# EAGLE design Sprite (EAGLE 6.6.0)

## Sheet 1 of 2
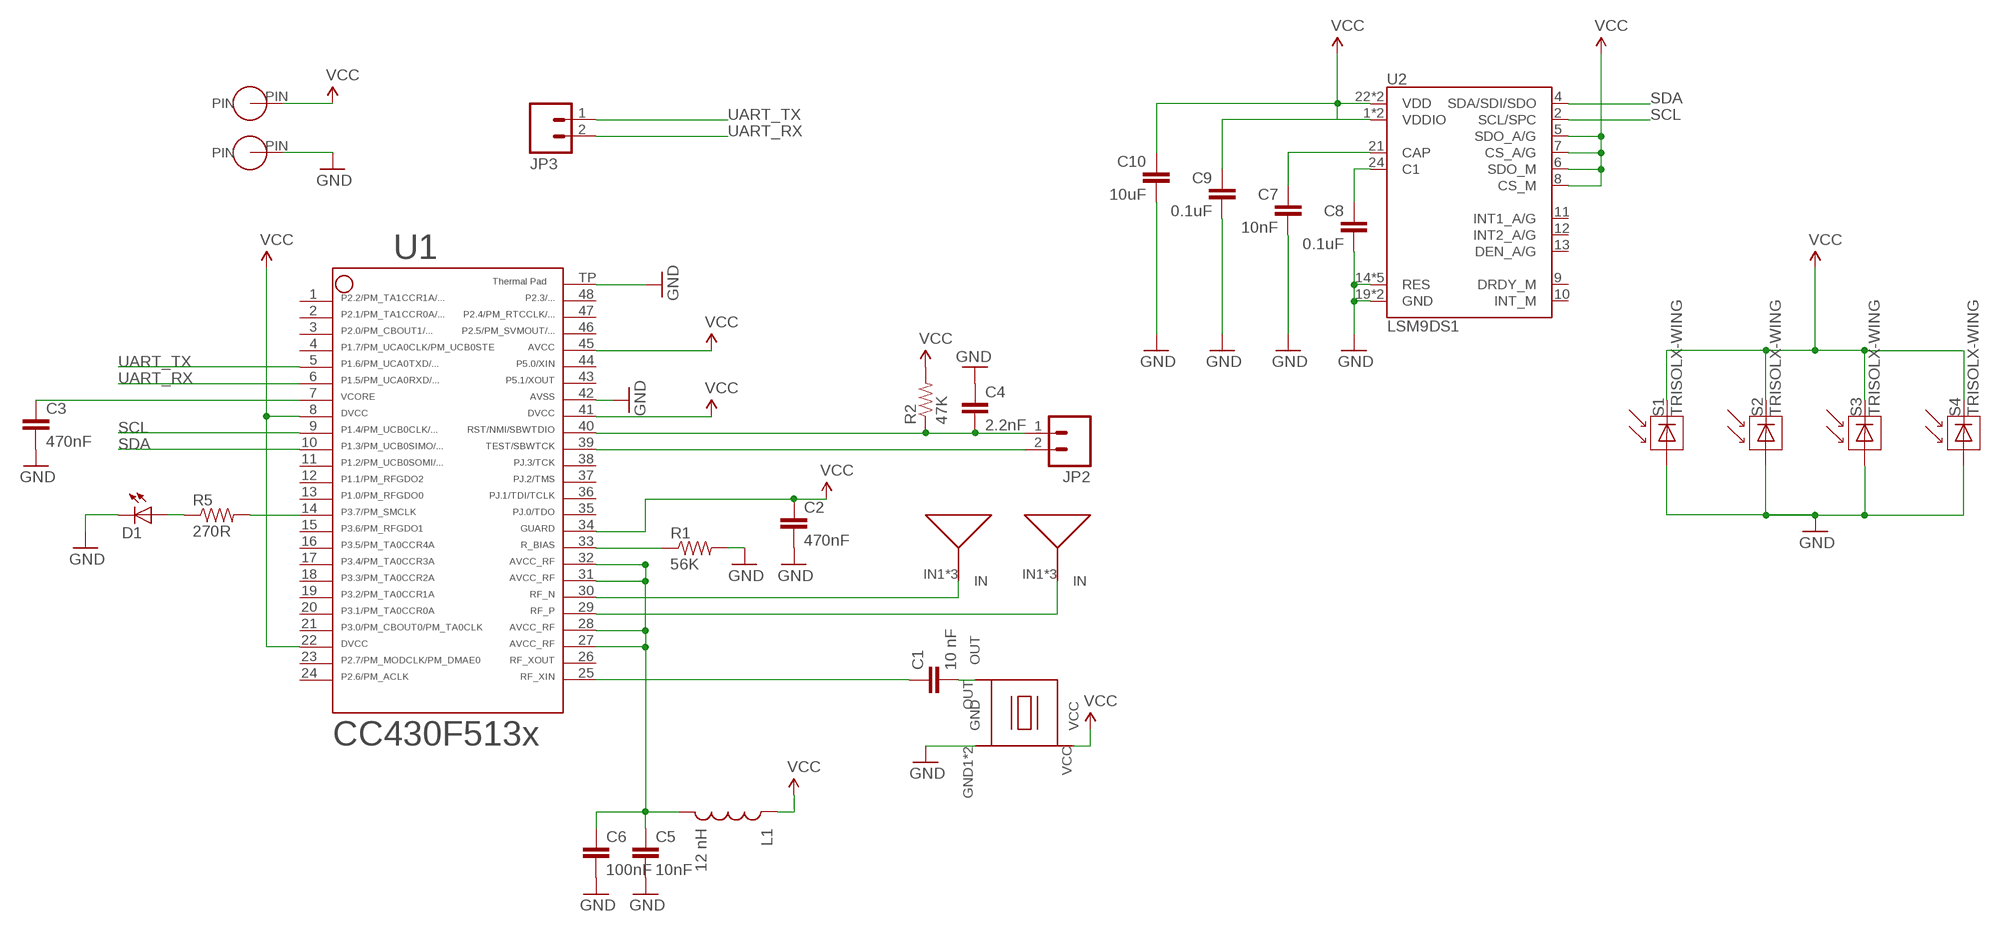
[diagram p0: schematic, sheet 1]

### Parts
ANT-N  ANTENNA  [ANTENNA]
ANT-P  ANTENNA  [ANTENNA]
C1  10 nF  CAP0603-CAP  [0603-CAP]
C2  470nF  CAP0603-CAP  [0603-CAP]
C3  470nF  CAP0603-CAP  [0603-CAP]
C4  2.2nF  CAP0603-CAP  [0603-CAP]
C5  10nF  CAP0603-CAP  [0603-CAP]
C6  100nF  CAP0603-CAP  [0603-CAP]
C7  10nF  CAP0603-CAP  [0603-CAP]
C8  0.1uF  CAP0603-CAP  [0603-CAP]
C9  0.1uF  CAP0603-CAP  [0603-CAP]
C10  10uF  CAP0603-CAP  [0603-CAP]
D1  LED0603  [LED-0603]
JP2  M02PTH  [1X02]
JP3  M02PTH  [1X02]
L1  12 nH  INDUCTOR0603  [0603]
P1  SPRITE_PIN  [SPRITE_PIN]
P2  SPRITE_PIN  [SPRITE_PIN]
R1  56K  RESISTOR0603-RES  [0603-RES]
R2  47K  RESISTOR0603-RES  [0603-RES]
R5  270R  RESISTOR0603-RES  [0603-RES]
S1  TRISOLX-WING  [TRISOLX-T01]
S2  TRISOLX-WING  [TRISOLX-T01]
S3  TRISOLX-WING  [TRISOLX-T01]
S4  TRISOLX-WING  [TRISOLX-T01]
U1  CC430F5137  CC430F513X---RGZ48  [RGZ48]
U2  LSM9DS1  [LGA24-8X4]
X1  TCXO_7Z  [TXC_7Z]

### Nets
GND: C2.2 C3.2 C4.1 C5.2 C6.2 C7.2 C8.2 C9.2 C10.2 D1.C P2.PIN R1.2 S1.P$3(A) S2.P$3(A) S3.P$3(A) S4.P$3(A) U1.42 U1.TP U2.14(RES) U2.15(RES) U2.16(RES) U2.17(RES) U2.18(RES) U2.19(GND) U2.20(GND) X1.GND1(GND) X1.GND2(GND)
N$1: C1.1 U1.25
N$2: R5.2 U1.14
N$3: R1.1 U1.33
N$4: C3.1 U1.7
N$5: C7.1 U2.21(CAP)
N$6: C8.1 U2.24(C1)
N$11: D1.A R5.1
N$12: C1.2 X1.OUT
RFN: ANT-N.IN1(IN) ANT-N.IN2(IN) ANT-N.IN3(IN) U1.30
RFP: ANT-P.IN1(IN) ANT-P.IN2(IN) ANT-P.IN3(IN) U1.29
RST: C4.2 JP2.1 R2.1 U1.40
SCL: U1.9 U2.2(SCL/SPC)
SDA: U1.10 U2.4(SDA/SDI/SDO)
TEST: JP2.2 U1.39
UART_RX: JP3.2 U1.6
UART_TX: JP3.1 U1.5
VCC: C2.1 C9.1 C10.1 L1.1 P1.PIN R2.2 S1.P$2(C) S2.P$2(C) S3.P$2(C) S4.P$2(C) U1.8 U1.22 U1.34 U1.41 U1.45 U2.1(VDDIO) U2.3(VDDIO) U2.5(SDO_A/G) U2.6(SDO_M) U2.7(CS_A/G) U2.8(CS_M) U2.22(VDD) U2.23(VDD) X1.VCC
VCCRF: C5.1 C6.1 L1.2 U1.27 U1.28 U1.31 U1.32
Unconnected: U1.1 U1.2 U1.3 U1.4 U1.11 U1.12 U1.13 U1.15 U1.16 U1.17 U1.18 U1.19 U1.20 U1.21 U1.23 U1.24 U1.26 U1.35 U1.36 U1.37 U1.38 U1.43 U1.44 U1.46 U1.47 U1.48 U2.9(DRDY_M) U2.10(INT_M) U2.11(INT1_A/G) U2.12(INT2_A/G) U2.13(DEN_A/G)

## Sheet 2 of 2

## Library data of the parts
ANT-N ANT-P = SpriteAntenna:ANTENNA
C1-C10 = SparkFun:CAP: Capacitor Standard 0603 ceramic capacitor, and 0.1" leaded capacitor.
D1 = SparkFun:LED: LEDs Standard schematic elements and footprints for 5mm, 3mm, 1206, and 0603 sized LEDs. 5mm - Spark Fun Electronics SKU : COM-00529 (and others)
JP2 JP3 = SparkFun:M02: Header 2 Standard 2-pin 0.1" header. Use with straight break away headers (SKU : PRT-00116), right angle break away headers (PRT-00553), swiss pins (PRT-00743), machine pins (PRT-00117), and female headers (PRT-00115). Molex polarized connector foot print use with SKU : PRT-08233 with associated crimp pins and housings.
L1 = SparkFun:INDUCTOR: Inductors Basic Inductor/Choke - 0603 and 1206. Footprints are not proven and vary greatly between part numbers.
P1 P2 = SpritePin:SPRITE_PIN
R1 R2 R5 = SparkFun:RESISTOR: Resistor Basic schematic elements and footprints for 0603, 1206, and PTH resistors.
S1-S4 = TriSolX_QzQube:TRISOLX-WING
U1 = TI_MSP430_v16:CC430F513X---RGZ48: ***CC430F513X***RGZ48 ** ** Rev 1.0 ** 06/2010 * http://focus.ti.com/docs/prod/folders/print/cc430f5137.html
U2 = LSM9DS1:LSM9DS1: LSM9DS1 3D accelerometer, gyroscope & magnetometer The LSM9DS1 is a system-in-package featuring a 3D digital linear acceleration sensor, a 3D digital angular rate sensor, and a 3D digital magnetic sensor. The LSM9DS1 has a linear acceleration full scale of ±2g/±4g/±8/±16 g, a magnetic field full scale of ±4/±8/±12/±16 gauss and an angular rate of ±245/±500/±2000 dps. The LSM9DS1 includes an I2 C serial bus interface supporting standard and fast mode (100 kHz and 400 kHz) and an SPI serial standard interface. Magnetic, accelerometer and gyroscope sensing can be enabled or set in power-down mode separately for smart power management. The LSM9DS1 is available in a plastic land grid array package (LGA) and it is guaranteed to operate over an extended temperature range from -40 °C to +85 °C.; PROD_ID: IC-12536
X1 = SpriteTCXO:TCXO_7Z

## Board
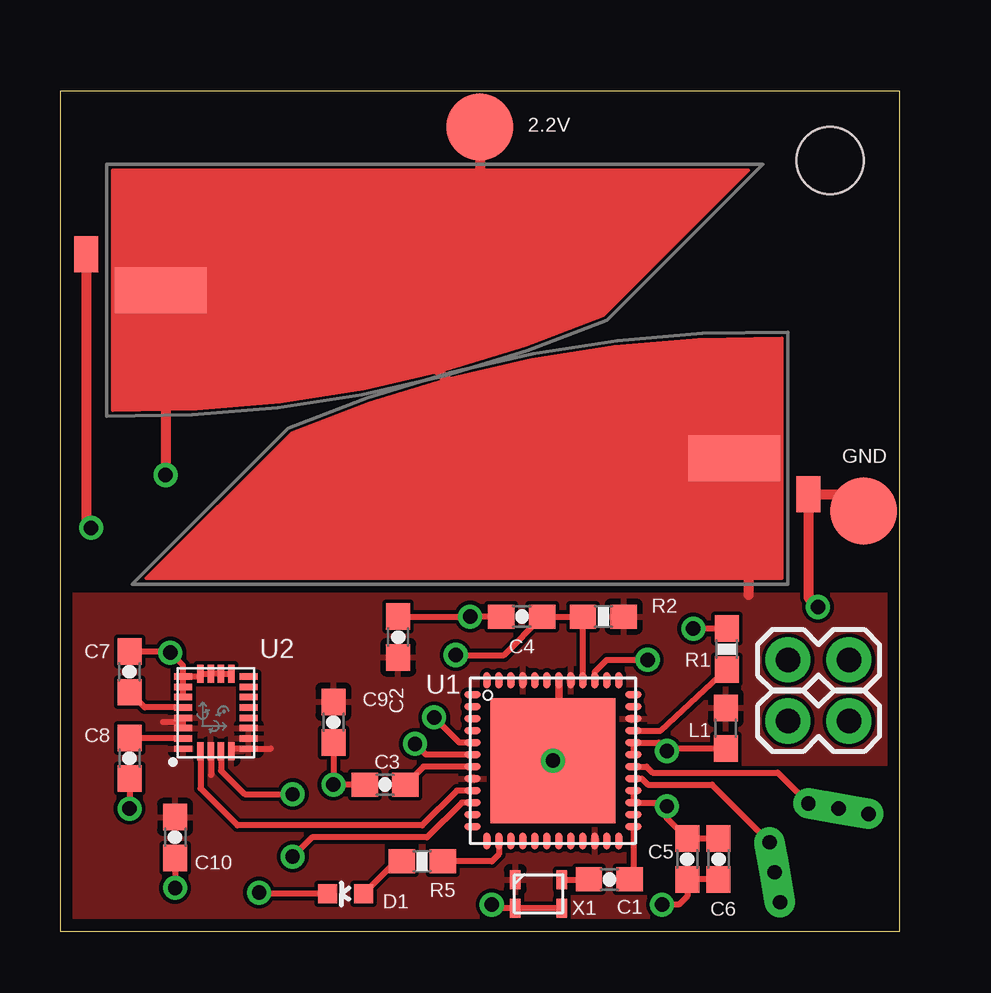
[diagram p1: board, top side]
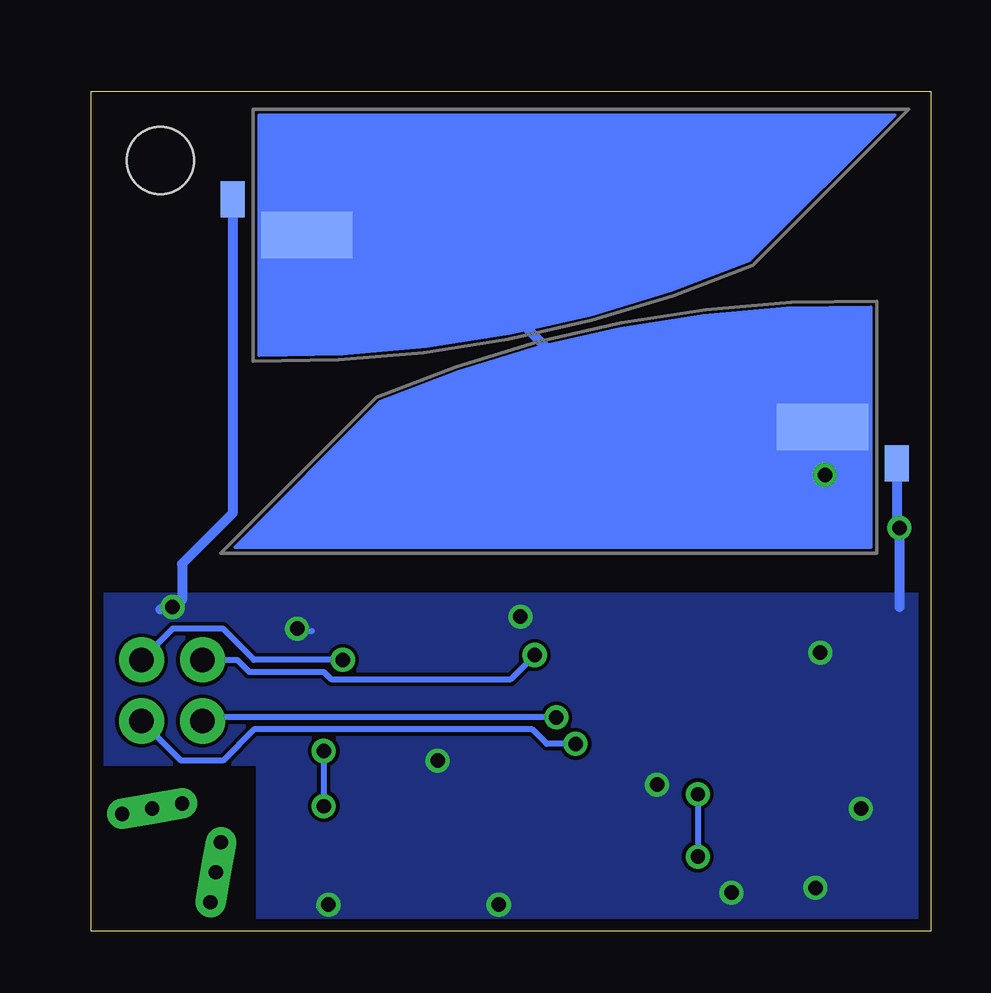
[diagram p2: board, bottom side, seen from below]

Size 35 x 35 mm. Coordinates in mm from the lower left corner, seen from the top.
Outline: 0,0 35,0 35,35 0,35 0,0
Copper layers (1*16): Top 0.0178mm / dielectric 59mil / Bottom 0.0178mm
Design rules "SSC-EAGLE-2Lyr_v1.0.0.3": minimum track width 6mil, minimum drill 14mil, track to track 6mil, track to pad 6mil, pad to pad 6mil, via to via 6mil, smd to smd 6mil, copper to edge 20mil, drill to drill 16mil, minimum pad ring 8mil, minimum via ring 8mil, stop-mask expansion 3mil, vias tented up to drill 0mil, thermal gap 10mil
Holes 2.8 mm at 32.1,32.1

### Footprints (pad centres in the part's own frame; a part is rotated, then mirrored left to right if it is on the bottom)
ANTENNA = drill 0.6 pad 1.27 square: IN1 0,0 | drill 0.6 pad 1.27 offset: IN2 1.27,0; IN3 -1.27,0
0603-CAP = smd 1.1 x 1: 1 -0.85,0; 2 0.85,0
LED-0603 = smd 0.8 x 0.8: A 0,-0.75; C 0,0.75
1X02 = drill 1.016 pad 1.88: 1 0,0; 2 2.54,0
0603 = smd 1.1 x 1: 1 -0.85,0; 2 0.85,0
SPRITE_PIN = smd 2.794 x 2.794: PIN 0,0
0603-RES = smd 1.1 x 1: 1 -0.85,0; 2 0.85,0
TRISOLX-T01 = smd 3.81 x 1.93: P$2 -2,5 | smd 1 x 1.5: P$3 1.1,3.5
RGZ48 = smd 0.7 x 0.3: 1 -3.35,2.75; 2 -3.35,2.25; 3 -3.35,1.75; 4 -3.35,1.25; 5 -3.35,0.75; 6 -3.35,0.25; 7 -3.35,-0.25; 8 -3.35,-0.75; 9 -3.35,-1.25; 10 -3.35,-1.75; 11 -3.35,-2.25; 12 -3.35,-2.75; 25 3.35,-2.75; 26 3.35,-2.25; 27 3.35,-1.75; 28 3.35,-1.25; 29 3.35,-0.75; 30 3.35,-0.25; 31 3.35,0.25; 32 3.35,0.75; 33 3.35,1.25; 34 3.35,1.75; 35 3.35,2.25; 36 3.35,2.75 | smd 0.3 x 0.7: 13 -2.75,-3.35; 14 -2.25,-3.35; 15 -1.75,-3.35; 16 -1.25,-3.35; 17 -0.75,-3.35; 18 -0.25,-3.35; 19 0.25,-3.35; 20 0.75,-3.35; 21 1.25,-3.35; 22 1.75,-3.35; 23 2.25,-3.35; 24 2.75,-3.35; 37 2.75,3.35; 38 2.25,3.35; 39 1.75,3.35; 40 1.25,3.35; 41 0.75,3.35; 42 0.25,3.35; 43 -0.25,3.35; 44 -0.75,3.35; 45 -1.25,3.35; 46 -1.75,3.35; 47 -2.25,3.35; 48 -2.75,3.35 | smd 5.2 x 5.2: TP 0,0
LGA24-8X4 = smd 0.27 x 0.75: 1 -1.505,1.365; 6 -1.505,-1.365; 7 -1.075,-1.365; 8 -0.645,-1.365; 9 -0.215,-1.365; 10 0.215,-1.365; 11 0.645,-1.365; 12 1.075,-1.365; 13 1.505,-1.365; 18 1.505,1.365; 19 1.075,1.365; 20 0.645,1.365; 21 0.215,1.365; 22 -0.215,1.365; 23 -0.645,1.365; 24 -1.075,1.365 | smd 0.75 x 0.27: 2 -1.615,0.645; 3 -1.615,0.215; 4 -1.615,-0.215; 5 -1.615,-0.645; 14 1.615,-0.645; 15 1.615,-0.215; 16 1.615,0.215; 17 1.615,0.645
TXC_7Z = smd 0.44 x 0.79: GND1 -0.97,-0.595; GND2 0.97,-0.595; OUT 0.97,0.595; VCC -0.97,0.595

### Placement (x,y rotation side)
ANT-N  32.45,5.1 170 top
ANT-P  29.8,2.45 100 top
C1  22.9,2.15 180 top
C2  14.1,12.25 90 top
C3  13.55,6.1 180 top
C4  19.25,13.1 0 top
C5  26.15,3 270 top
C6  27.45,3 270 top
C7  2.9,10.8 90 top
C8  2.9,7.2 270 top
C9  11.4,8.7 270 top
C10  4.8,3.9 270 top
D1  11.9,1.55 90 top
JP2  30.35,11.3 0 top
JP3  30.35,8.75 0 top
L1  27.75,8.45 270 top
P1  17.5,33.5 0 top
P2  33.5,17.5 0 top
R1  27.8,11.75 90 top
R2  22.65,13.1 0 top
R5  15.1,2.9 0 top
S1  30.1,14.7 0 top
S2  2.2,31.7 180 top
S3  2.5,16 0 bottom
S4  28,34 180 bottom
U1  20.55,7.1 0 top
U2  6.5,9.1 90 top
X1  19.95,1.55 0 top

### Tracks (layer width: path | path; a pad name or v marks a point on that pad's centre or on a via)
GND  (via drill 0.6, 0.6 pad 0.25)
  Top 0.254: 20.8,7.75 U1.TP | C3.2 v11.4,6.1 C9.2 | R1.2 v26.4,12.6 | X1.GND2 X1.GND1 18.14,0.95 v18,1.1 | C4.1 v17.1,13.1 C2.2 | C6.2 C5.2 26.15,1.45 25.8,1.1 v25.1,1.1 | U2.20 U2.19 U2.18 | U2.14 U2.15 U2.16 U2.17 5.86,10.61 U2.18 | U2.18 5.13,11.06 v4.6,11.6 4.55,11.65 C7.2 | C8.2 v2.9,5.1 | D1.C 8.35,1.55 v8.3,1.6 | C10.2 v4.8,1.8
  Top 0.305: U1.42 20.8,7.75
  Top 0.406: S2.P$3 1.1,17 v1.3,16.8 | v31.6,13.5 31.2,13.9 S1.P$3 32.8,18.2 P2.PIN
  Bottom 0.254: v11.4,6.1 11.4,6.2 | v26.4,12.6 25.8,12.5 | v18,1.1 18,1.2 17.9,1.3 | v17.1,13.1 16.9,13.1 | v25.1,1.1 25.5,1 | v4.6,11.6 4.5,11.7 | v2.9,5.1 2.9,4.9 | v8.3,1.6 8.2,1.7 | v4.8,1.8 4.8,1.7 4.9,1.6
  Bottom 0.406: 1.3,13.5 v1.3,16.8 1.4,16.9 S3.P$3 | S4.P$3 29.1,17.4 31.2,15.3 31.2,13.8 | v31.6,13.5 32.1,13.4
  other vias: 20.55,7.1
  pour Bottom: 0,0 28,0 28,7 35,7 35,14 0,14
N$1
  Top 0.254: U1.25 23.9,2.3 C1.1
N$2
  Top 0.254: U1.14 18.3,3.2 18,2.9 R5.2
N$3
  Top 0.254: U1.33 25.05,8.35 R1.1
N$4
  Top 0.254: U1.7 15.15,6.85 C3.1
N$5
  Top 0.254: U2.21 3.54,9.31 C7.1
N$6
  Top 0.254: U2.24 2.92,8.03 C8.1
N$11
  Top 0.254: R5.1 14,2.9 D1.A
N$12
  Top 0.254: X1.OUT C1.2
RFN
  Top 0.254: U1.30 24.45,6.85 24.7,6.6 29.92,6.6 ANT-N.IN2
  Top 0.305: ANT-N.IN3 ANT-N.IN1
  Top 0.53: ANT-N.IN2 ANT-N.IN3
RFP
  Top 0.254: U1.29 24.25,6.35 24.5,6.1 27.18,6.1 ANT-P.IN2
  Top 0.305: ANT-P.IN2 ANT-P.IN1
  Top 0.53: ANT-P.IN3 ANT-P.IN2
RST  (via drill 0.6)
  Top 0.254: U1.40 R2.1 C4.2 18.5,11.5 v16.5,11.5
  Bottom 0.254: JP2.1 28.9,11.3 28.4,10.8 25.3,10.8 25,10.5 17.5,10.5 v16.5,11.5
SCL
  Top 0.254: U1.9 16.55,5.85 15.1,4.4 7.4,4.4 5.86,5.95 U2.2
SDA  (via drill 0.6)
  Top 0.254: U1.10 16.75,5.35 15.3,3.9 10.5,3.9 v9.7,3.1 | U2.4 6.71,6.68 7.7,5.7 v9.7,5.7
  Bottom 0.254: v9.7,5.7 v9.7,3.1
TEST  (via drill 0.6)
  Top 0.254: U1.39 22.3,10.8 22.8,11.3 v24.5,11.3
  Bottom 0.254: v24.5,11.3 28.2,11.3 29.5,12.6 31.59,12.6 JP2.2
UART_RX  (via drill 0.6)
  Top 0.254: U1.6 15.25,7.35 v14.8,7.8
  Bottom 0.254: v14.8,7.8 16,7.8 16.6,8.4 28.2,8.4 29.5,7.1 31.24,7.1 JP3.2
UART_TX  (via drill 0.6)
  Top 0.254: U1.5 16.65,7.85 v15.6,8.9
  Bottom 0.254: v15.6,8.9 30.2,8.9 JP3.1
VCC  (via drill 0.6)
  Top 0.254: U2.23 5.13,8.7 4.3,8.7 | 8.8,7.6 8.8,7.59 U2.6 7.14,7.59 U2.5 | U2.3 6.3,6.5
  Top 0.406: 27.3,18.9 20.2,18.9 13.7,25.4 13.7,26.4 13.4,26.7 | 27.3,18.9 S1.P$2 | 27.3,18.9 28.7,18.9 28.7,14 | v4.4,19 4.4,26.7 S2.P$2 13.4,26.7 | P1.PIN 17.5,30.8 13.4,26.7
  Bottom 0.406: S4.P$2 25.1,28.1 19.8,28.1 12.7,21 S3.P$2 4.5,19 v4.4,19
  pour Top: 28,0 0,0 0,14 35,14 35,7 28,7
VCCRF  (via drill 0.6)
  Top 0.254: U1.28 U1.27 25.15,5.35 v25.3,5.2 25.3,4.7 C5.1 C6.1 | U1.31 U1.32 24.95,7.85 v25.3,7.5 25.4,7.6 L1.2
  Bottom 0.254: v25.3,7.5 v25.3,5.2

### Text on the board
tNames: 2.2V | GND
201bmp: Sprite v2.6